# Altium schematic sheet ArduinoUnoShield.SchDoc
size A4
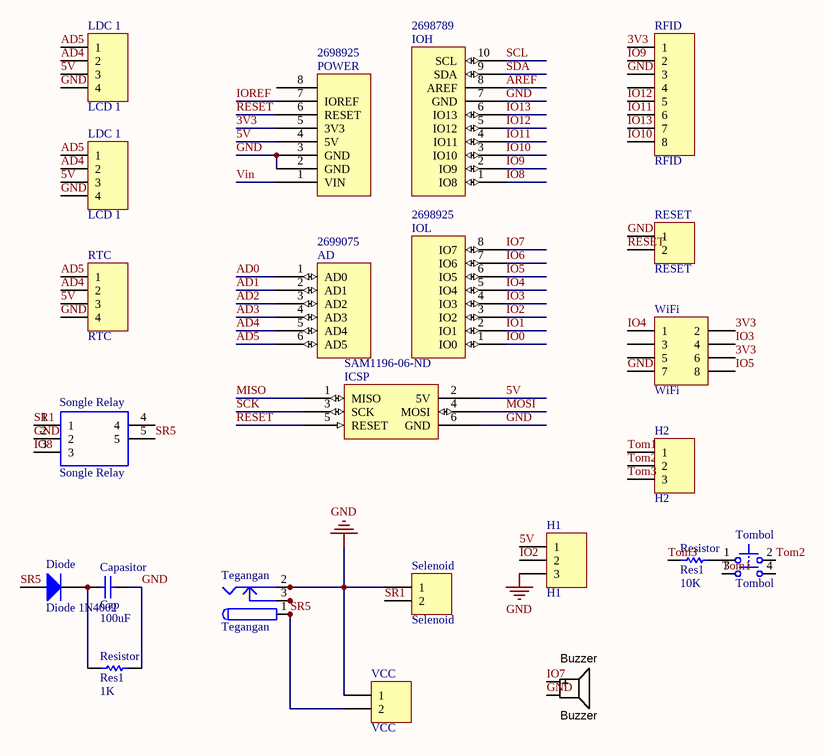
[diagram p0: ArduinoUnoShield.SchDoc]

## Parts
(Parts that share a designator on the sheet are numbered #1, #2 ... from top to bottom, then left to right.)
AD  Supplier Part Number 4: 2699075  [Header 6x1 8.5mm]  (hidden comment: AD)
Buzzer  Manufacturer Part Number 1: Buzzer  [BUZZER_12.0X8.5MM]  (hidden comment: Alternate part: 3100-932)
Capasitor  Cap  value 100uF  [RAD-0.3]
Diode  Diode 1N4002  [DO-41]
H1  H1  [HDR1X3]
H2  H2  [HDR1X3]
ICSP  Supplier Part Number 5: SAM1196-06-ND  [ICSP]  (hidden comment: ICSP)
IOH  Supplier Part Number 3: 2698789  [Header 10x1 8.5mm]  (hidden comment: IOH)
IOL  Supplier Part Number 4: 2698925  [Header 8x1 8.5mm]  (hidden comment: IOL)
LDC_1#1  LCD 1  [HDR1X4]
LDC_1#2  LCD 1  [HDR1X4]
POWER  Supplier Part Number 4: 2698925  [Header 8x1 8.5mm]  (hidden comment: POWER_UNO)
RESET  RESET  [HDR1X2]
Resistor#1  Res1  value 10K  [AXIAL-0.3]
Resistor#2  Res1  value 1K  [AXIAL-0.3]
RFID  RFID  [HDR1X8]
RTC  RTC  [HDR1X4]
Selenoid  Selenoid  [HDR1X2]
Songle_Relay  Songle Relay  [SRD]
Tegangan  Tegangan  [KLD-0202]
Tombol  Tombol  [IT-2175]
VCC  VCC  [HDR1X2]
WiFi  WiFi  [HDR2X4]

## Nets
GND: Buzzer.2(Negative) Capasitor.2 H1.3 ICSP.6(GND) IOH.7(GND) LDC_1#1.4 LDC_1#2.4 POWER.2(GND) POWER.3(GND) RESET.1 Resistor#2.2 RFID.3 RTC.4 Selenoid.1 Songle_Relay.2 Tegangan.2 Tegangan.2A Tegangan.2B VCC.1 WiFi.7
3V3: POWER.5(3V3) RFID.1 WiFi.2 WiFi.6
5V: H1.1 ICSP.2(5V) LDC_1#1.3 LDC_1#2.3 POWER.4(5V) RTC.3
AD0: AD.1(AD0)
AD1: AD.2(AD1)
AD2: AD.3(AD2)
AD3: AD.4(AD3)
AD4: AD.5(AD4) LDC_1#1.2 LDC_1#2.2 RTC.2
AD5: AD.6(AD5) LDC_1#1.1 LDC_1#2.1 RTC.1
AREF: IOH.8(AREF)
IO0: IOL.1(IO0)
IO1: IOL.2(IO1)
IO2: H1.2 IOL.3(IO2)
IO3: IOL.4(IO3) WiFi.4
IO4: IOL.5(IO4) WiFi.1
IO5: IOL.6(IO5) WiFi.8
IO6: IOL.7(IO6)
IO7: Buzzer.1(Positive) IOL.8(IO7)
IO8: IOH.1(IO8) Songle_Relay.3
IO9: IOH.2(IO9) RFID.2
IO10: IOH.3(IO10) RFID.8
IO11: IOH.4(IO11) RFID.6
IO12: IOH.5(IO12) RFID.5
IO13: IOH.6(IO13) RFID.7
IOREF: POWER.7(IOREF)
MISO: ICSP.1(MISO)
MOSI: ICSP.4(MOSI)
RESET: ICSP.5(RESET) POWER.6(RESET) RESET.2
SCK: ICSP.3(SCK)
SCL: IOH.10(SCL)
SDA: IOH.9(SDA)
SR1: Selenoid.2 Songle_Relay.1
SR5: Diode.1(A) Songle_Relay.5 Tegangan.1 Tegangan.1A Tegangan.1B VCC.2
Tom1: H2.1 Tombol.3
Tom2: H2.2 Tombol.2
Tom3: H2.3 Resistor#1.1
Vin: POWER.1(VIN)
NetCapasitor_1: Capasitor.1 Diode.2(K) Resistor#2.1
NetResistor#1_2: Resistor#1.2 Tombol.1
NetTegangan_3: Tegangan.3 Tegangan.3A Tegangan.3B

Not connected (* = marked no-connect by the designer): POWER 8; RFID 4; Songle_Relay 4; Tombol 4; WiFi 3 5

## Library data of the parts
Buzzer = BZ_12x8.5x6.5_2kHz: Speaker, Magnetic Transducer; Manufacturer 1: CUI Inc; Ratings: 2048 ±200 Hz; SCDType: source; Package / Case: 6.5mm pitch; Material: Noryl SE1-J; Supplier 1: Digi-Key; Supplier Part Number 1: 102-1152-ND
Capasitor = Cap: Capacitor; Published: 8-Jun-2000; LatestRevisionDate: 17-Jul-2002; LatestRevisionNote: Re-released for DXP Platform.; PackageReference: RAD-0.3; Publisher: Altium Limited; PackageDescription: Radial Cap, Thru-Hole; 2 Leads; 0.3 in Pin Spacing
Diode = Diode 1N4002: 1 Amp General Purpose Rectifier; Published: 8-Jun-2000; LatestRevisionDate: 17-Jul-2002; LatestRevisionNote: Re-released for DXP Platform.; DatasheetVersion: 1998; PackageVersion: Aug-1999; PackageReference: DO-41; Publisher: Altium Limited; PackageDescription: Diode, Axial; Body 5.2 x 2.7 mm (LxDia. max), Lead Dia. 0.86 mm (max); Code_JEDEC: DO-204-AL; ComponentLink1Description: Manufacturer Link; ComponentLink1URL: http://www.fairchildsemi.com/; ComponentLink2Description: Datasheet; ComponentLink2URL: http://www.fairchildsemi.com/ds/1N%2F1N4001.pdf
H1 H2 = Header 3: Header, 3-Pin; LatestRevisionDate: 17-Jul-2002; LatestRevisionNote: Re-released for DXP Platform.; Publisher: Altium Limited
LDC_1#1 LDC_1#2 RTC = Header 4: Header, 4-Pin; LatestRevisionDate: 17-Jul-2002; LatestRevisionNote: Re-released for DXP Platform.; Publisher: Altium Limited
RESET Selenoid VCC = Header 2: Header, 2-Pin; LatestRevisionDate: 17-Jul-2002; LatestRevisionNote: Re-released for DXP Platform.; Publisher: Altium Limited
Resistor#1 Resistor#2 = Res1: Resistor; Published: 8-Jun-2000; LatestRevisionDate: 17-Jul-2002; LatestRevisionNote: Re-released for DXP Platform.; PackageReference: AXIAL-0.3; Publisher: Altium Limited; PackageDescription: Axial Device, Thru-Hole; 2 Leads; 0.3 in Pin Spacing
RFID = Header 8: Header, 8-Pin; LatestRevisionDate: 17-Jul-2002; LatestRevisionNote: Re-released for DXP Platform.; Publisher: Altium Limited
Songle_Relay = SRD-12VDC-SL-C: SRD Relay, ISO9002, 10A Switching Cap. Sealed Type, 0.36W, 1 Form C; Supplier_Name: RS; RS Part Number: *; Manufacturer_Name: Songle Relay; Manufacturer_Part_Number: SRD-12VDC-SL-C; Datasheet Link: http://www.songle.com/en/pdf/20084141716341001.pdf; Height: mm; Allied_Number: *; 3D Package: *; Other Part Number: *
Tegangan = PWR2.5: Low Voltage Power Supply Connector; Published: 17-Dec-2003; DatasheetDocument: 09-May-2002; Publisher: Altium Limited; ComponentLink1Description: Manufacturer Link; ComponentLink1URL: http://domino.kycon.com/internet/Products.html
Tombol = IT-2175: Tactile Switch, DPST; Thru-Hole; Vertical; Rating DC 12V, 50mA (max); PackageDocument: Rev.0; Published: 6-Jun-2005; DatasheetDocument: Rev.0; PackageReference: IT-2175; Publisher: Altium Limited; ComponentLink1Description: Manufacturer Link; ComponentLink1URL: http://www.ilswitch.com/; ComponentLink2Description: Device Overview; ComponentLink2URL: http://www.ilswitch.com/list.php?ac_id=010112&ai_id=91
WiFi = Header 4X2: Header, 4-Pin, Dual row; LatestRevisionDate: 17-Jul-2002; LatestRevisionNote: Re-released for DXP Platform.; Publisher: Altium Limited
AD = AD: Supplier 1: Arrow; Supplier Part Number 1: 2699089; Supplier 2: Digi-Key; Supplier Part Number 2: SAM1198-06-ND; Supplier 3: Arrow; Supplier Part Number 3: 2699088; Supplier 4: Arrow
ICSP = ICSP: Supplier 1: Arrow; Supplier Part Number 1: 2699117; Supplier 2: Arrow; Supplier Part Number 2: 2699116; Supplier 3: Digi-Key; Supplier Part Number 3: SAM1185-06-ND; Supplier 4: Arrow; Supplier Part Number 4: 2699091; Supplier 5: Digi-Key
IOH = IOH: Supplier 1: Arrow; Supplier Part Number 1: 2698803S4475693N1004; Supplier 2: Digi-Key; Supplier Part Number 2: SAM1198-10-ND; Supplier 3: Arrow
IOL = IOL: Supplier 1: Digi-Key; Supplier Part Number 1: SAM1198-08-ND; Supplier 2: Arrow; Supplier Part Number 2: 2698939; Supplier 3: Arrow; Supplier Part Number 3: 2698940; Supplier 4: Arrow
POWER = POWER_UNO: Supplier 1: Digi-Key; Supplier Part Number 1: SAM1198-08-ND; Supplier 2: Arrow; Supplier Part Number 2: 2698939; Supplier 3: Arrow; Supplier Part Number 3: 2698940; Supplier 4: Arrow